# EAGLE design EduBall_V1.1 (EAGLE 7.5.0)
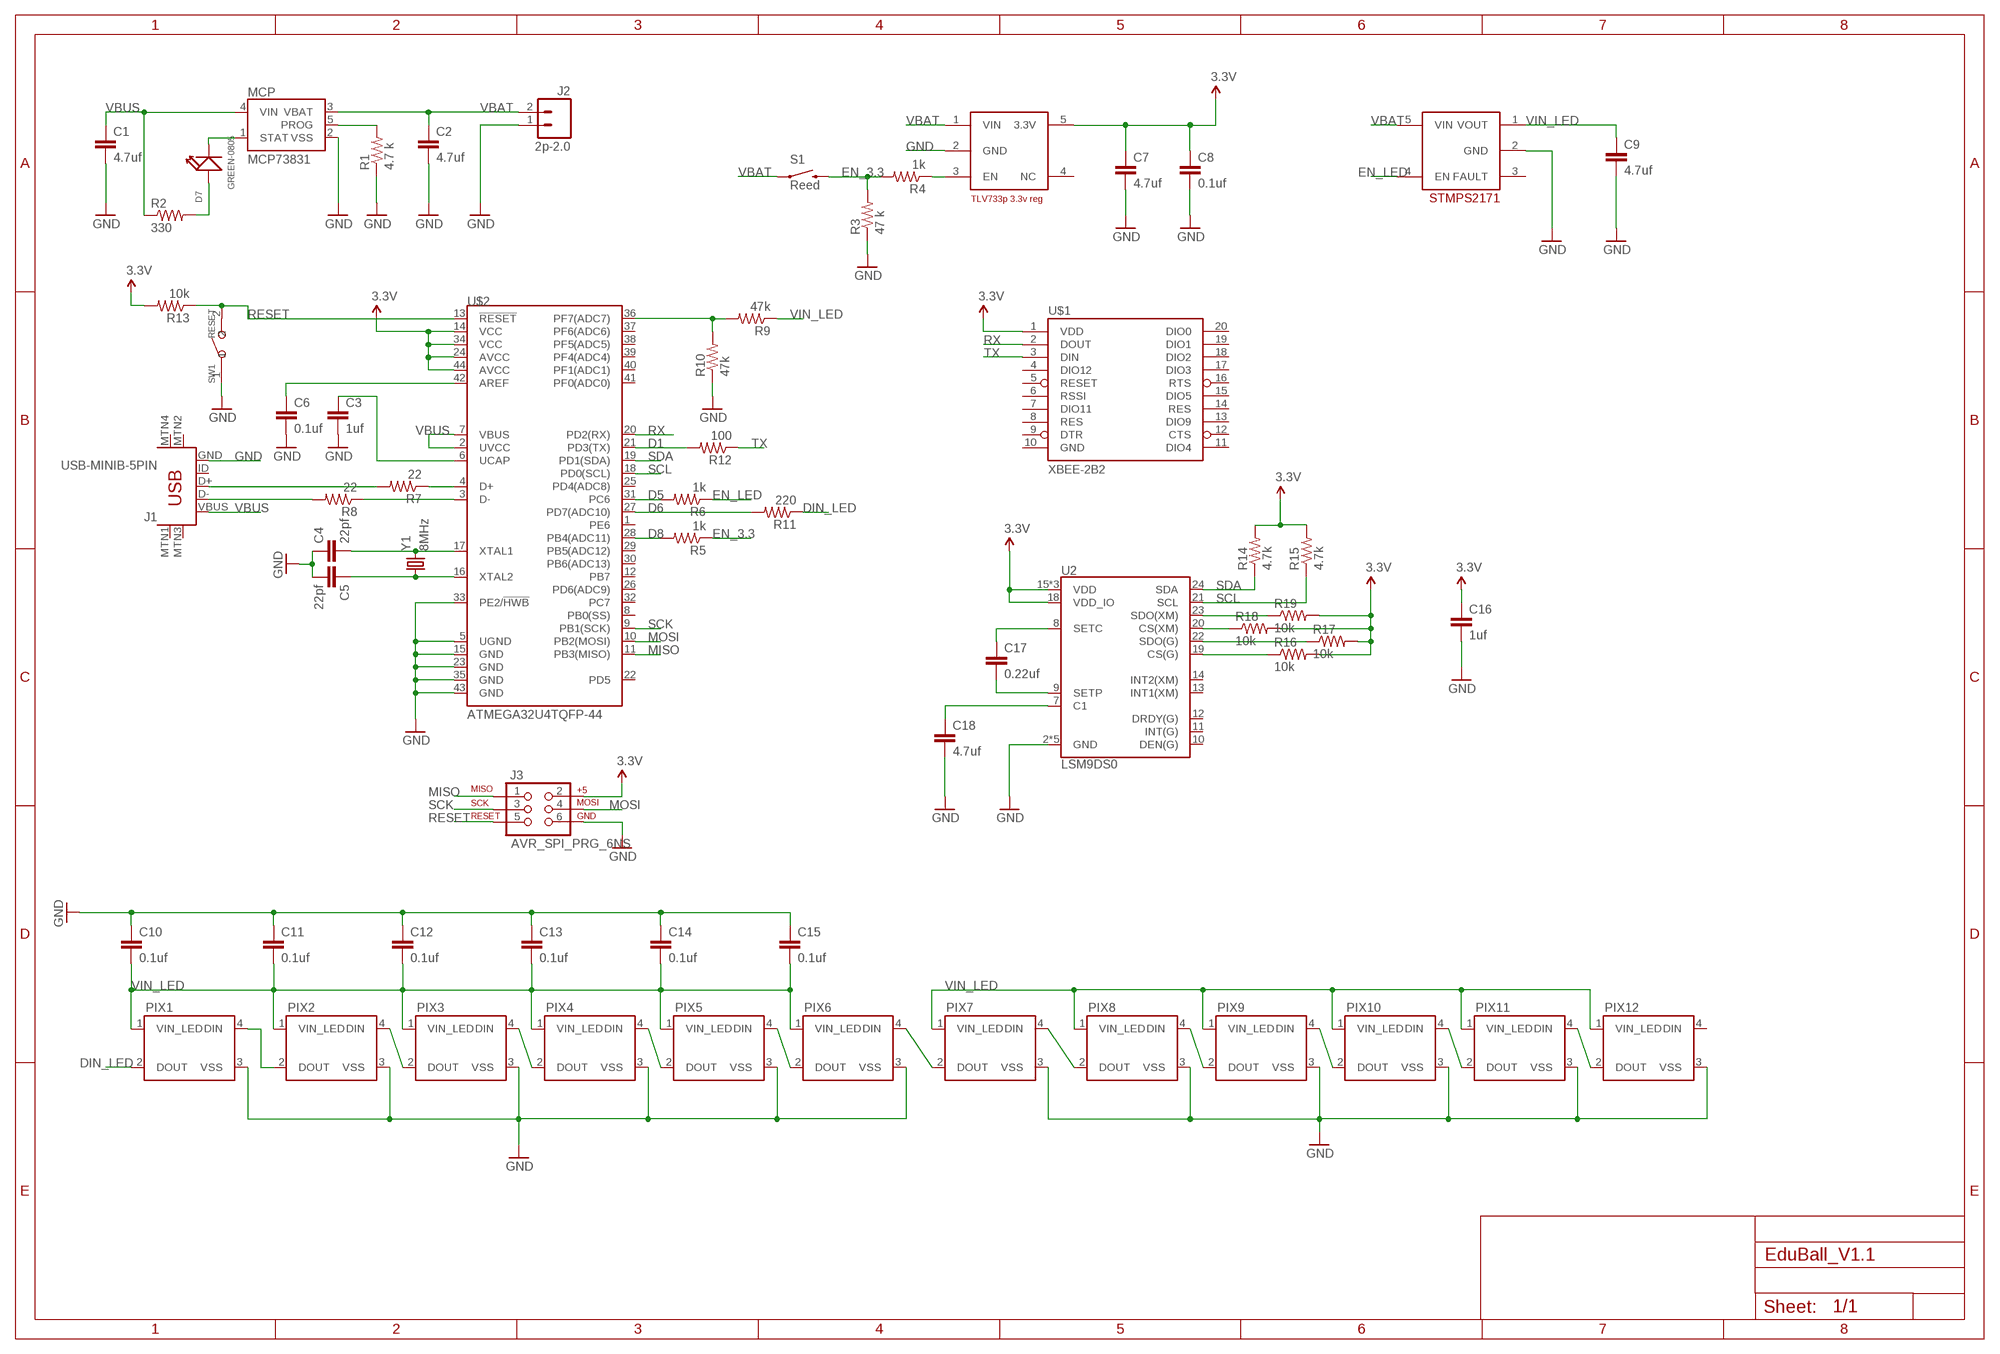
[diagram p0: schematic, sheet 1]

## Parts
C1  4.7uf  CAP0805  [0805]
C2  4.7uf  CAP0805  [0805]
C3  1uf  CAP0805  [0805]
C4  22pf  CAP0805  [0805]
C5  22pf  CAP0805  [0805]
C6  0.1uf  CAP0805  [0805]
C7  4.7uf  CAP0805  [0805]
C8  0.1uf  CAP0805  [0805]
C9  4.7uf  CAP0805  [0805]
C10  0.1uf  CAP0805  [0805]
C11  0.1uf  CAP0805  [0805]
C12  0.1uf  CAP0805  [0805]
C13  0.1uf  CAP0805  [0805]
C14  0.1uf  CAP0805  [0805]
C15  0.1uf  CAP0805  [0805]
C16  1uf  CAP0805  [0805]
C17  0.22uf  CAP0805  [0805]
C18  4.7uf  CAP0805  [0805]
D7  GREEN-0805  SMD-LED-CLEAR-GREEN(0805)  [LED-0805]
J1  USB-MINIB-5PIN  [USB-MINIB]
J2  2p-2.0  M02JST-PTH-VERT  [JST-2-PTH-VERT]
J3  AVR_SPI_PRG_6NS  [2X3-NS]
MCP  MCP73831  [SOT23-5]
PIX1  WS2812B  [WS2812B]
PIX2  WS2812B  [WS2812B]
PIX3  WS2812B  [WS2812B]
PIX4  WS2812B  [WS2812B]
PIX5  WS2812B  [WS2812B]
PIX6  WS2812B  [WS2812B]
PIX7  WS2812B  [WS2812B]
PIX8  WS2812B  [WS2812B]
PIX9  WS2812B  [WS2812B]
PIX10  WS2812B  [WS2812B]
PIX11  WS2812B  [WS2812B]
PIX12  WS2812B  [WS2812B]
R1  4.7 k  RESISTOR0805-RES  [0805]
R2  330  RESISTOR0805-RES  [0805]
R3  47 k  RESISTOR0805-RES  [0805]
R4  1k  RESISTOR0805-RES  [0805]
R5  1k  RESISTOR0805-RES  [0805]
R6  1k  RESISTOR0805-RES  [0805]
R7  22  RESISTOR0805-RES  [0805]
R8  22  RESISTOR0805-RES  [0805]
R9  47k  RESISTOR0805-RES  [0805]
R10  47k  RESISTOR0805-RES  [0805]
R11  220  RESISTOR0805-RES  [0805]
R12  100  RESISTOR0805-RES  [0805]
R13  10k  RESISTOR0805-RES  [0805]
R14  4.7k  RESISTOR0805-RES  [0805]
R15  4.7k  RESISTOR0805-RES  [0805]
R16  10k  RESISTOR0805-RES  [0805]
R17  10k  RESISTOR0805-RES  [0805]
R18  10k  RESISTOR0805-RES  [0805]
R19  10k  RESISTOR0805-RES  [0805]
S1  Reed  SWITCH-MOMENTARY-2PTH_REED  [REED_SWITCH_PTH]
STMP  STMPS2171  [SOT23-5]
SW1  RESET  SMD-BUTTON(2P-3.0X2.5X1.2+0.4MM)-B3U-1000P-2P-SMD  [SW2-2.6-3.0X2.5X1.2+0.4MM]
TLV  TLV3333P  [SOT23-5]
U2  LSM9DS0  [LGA-24]
U$1  XBEE-2B2  [XBEE-SILK]
U$2  ATMEGA32U4TQFP-44  [TQFP44]
Y1  8MHz  CRYSTALHC49US  [HC49US]

## Nets
3.3V: C7.1 C8.1 C16.1 J3.2 R13.2 R14.2 R15.2 R16.2 R17.2 R18.2 R19.2 TLV.5(3.3V) U2.15(VDD) U2.16(VDD) U2.17(VDD) U2.18(VDD_IO) U$1.1(VDD) U$2.14(VCC) U$2.24(AVCC) U$2.34(VCC) U$2.44(AVCC)
D1: R12.2 U$2.21(PD3(TX))
D5: R6.2 U$2.31(PC6)
D6: R11.2 U$2.27(PD7(ADC10))
D8: R5.2 U$2.28(PB4(ADC11))
DIN_LED: PIX1.2(DOUT) R11.1
EN_3.3: R3.2 R4.2 R5.1 S1.P$2
EN_LED: R6.1 STMP.4(EN)
GND: C1.2 C2.2 C3.2 C4.1 C5.2 C6.2 C7.2 C8.2 C9.2 C10.1 C11.1 C12.1 C13.1 C14.1 C15.1 C16.2 C18.2 J1.GND J2.1 J3.6 MCP.2(VSS) PIX1.3(VSS) PIX2.3(VSS) PIX3.3(VSS) PIX4.3(VSS) PIX5.3(VSS) PIX6.3(VSS) PIX7.3(VSS) PIX8.3(VSS) PIX9.3(VSS) PIX10.3(VSS) PIX11.3(VSS) PIX12.3(VSS) R1.1 R3.1 R10.1 STMP.2(GND) SW1.1 TLV.2(GND) U2.2(GND) U2.3(GND) U2.4(GND) U2.5(GND) U2.6(GND) U$2.5(UGND) U$2.15(GND) U$2.23(GND) U$2.33(PE2/!HWB) U$2.35(GND) U$2.43(GND)
MISO: J3.1 U$2.11(PB3(MISO))
MOSI: J3.4 U$2.10(PB2(MOSI))
N$1: MCP.5(PROG) R1.2
N$2: PIX1.4(DIN) PIX2.2(DOUT)
N$3: R4.1 TLV.3(EN)
N$4: D7.- MCP.1(STAT)
N$5: D7.+ R2.2
N$6: PIX2.4(DIN) PIX3.2(DOUT)
N$7: PIX3.4(DIN) PIX4.2(DOUT)
N$8: PIX4.4(DIN) PIX5.2(DOUT)
N$9: PIX5.4(DIN) PIX6.2(DOUT)
N$10: PIX6.4(DIN) PIX7.2(DOUT)
N$11: PIX7.4(DIN) PIX8.2(DOUT)
N$12: PIX8.4(DIN) PIX9.2(DOUT)
N$13: PIX9.4(DIN) PIX10.2(DOUT)
N$14: PIX10.4(DIN) PIX11.2(DOUT)
N$15: PIX11.4(DIN) PIX12.2(DOUT)
N$16: J1.D+ R7.2
N$17: R7.1 U$2.4(D+)
N$18: R8.1 U$2.3(D-)
N$19: J1.D- R8.2
N$20: C3.1 U$2.6(UCAP)
N$21: C6.1 U$2.42(AREF)
N$22: C18.1 U2.7(C1)
N$23: C4.2 U$2.17(XTAL1) Y1.2
N$24: C5.1 U$2.16(XTAL2) Y1.1
N$25: R9.2 R10.2 U$2.36(PF7(ADC7))
N$26: C17.2 U2.9(SETP)
N$27: C17.1 U2.8(SETC)
N$32: R19.1 U2.23(SDO(XM))
N$33: R18.1 U2.20(CS(XM))
N$34: R17.1 U2.22(SDO(G))
N$35: R16.1 U2.19(CS(G))
RESET: J3.5 R13.1 SW1.2 U$2.13(!RESET)
RX: U$1.2(DOUT) U$2.20(PD2(RX))
SCK: J3.3 U$2.9(PB1(SCK))
SCL: R15.1 U2.21(SCL) U$2.18(PD0(SCL))
SDA: R14.1 U2.24(SDA) U$2.19(PD1(SDA))
TX: R12.1 U$1.3(DIN)
VBAT: C2.1 J2.2 MCP.3(VBAT) S1.P$1 STMP.5(VIN) TLV.1(VIN)
VBUS: C1.1 J1.VBUS MCP.4(VIN) R2.1 U$2.2(UVCC) U$2.7(VBUS)
VIN_LED: C9.1 C10.2 C11.2 C12.2 C13.2 C14.2 C15.2 PIX1.1(VIN_LED) PIX2.1(VIN_LED) PIX3.1(VIN_LED) PIX4.1(VIN_LED) PIX5.1(VIN_LED) PIX6.1(VIN_LED) PIX7.1(VIN_LED) PIX8.1(VIN_LED) PIX9.1(VIN_LED) PIX10.1(VIN_LED) PIX11.1(VIN_LED) PIX12.1(VIN_LED) R9.1 STMP.1(VOUT)
Unconnected: J1.ID J1.MTN1(MTN2) J1.MTN2(MTN3) J1.MTN3(MTN1) J1.MTN4 PIX12.4(DIN) STMP.3(FAULT) TLV.4(NC) U2.10(DEN(G)) U2.11(INT(G)) U2.12(DRDY(G)) U2.13(INT1(XM)) U2.14(INT2(XM)) U$1.4(DIO12) U$1.5(RESET) U$1.6(RSSI) U$1.7(DIO11) U$1.8(RES) U$1.9(DTR) U$1.11(DIO4) U$1.12(CTS) U$1.13(DIO9) U$1.14(RES) U$1.15(DIO5) U$1.16(RTS) U$1.17(DIO3) U$1.18(DIO2) U$1.19(DIO1) U$1.20(DIO0) U$2.1(PE6) U$2.8(PB0(SS)) U$2.12(PB7) U$2.22(PD5) U$2.25(PD4(ADC8)) U$2.26(PD6(ADC9)) U$2.29(PB5(ADC12)) U$2.30(PB6(ADC13)) U$2.32(PC7) U$2.37(PF6(ADC6)) U$2.38(PF5(ADC5)) U$2.39(PF4(ADC4)) U$2.40(PF1(ADC1)) U$2.41(PF0(ADC0))

## Power pins joined to a net without a drawn wire
GND: U$1.10(GND)

## Library data of the parts
C1-C18 = SparkFun-Passives:CAP: Capacitor Standard 0603 ceramic capacitor, and 0.1" leaded capacitor.
D7 = Seeed-LED-2016:SMD-LED-CLEAR-GREEN(0805): 304090057; MPN: 17-215SYGC/S530-E2/TR8
J1 = SparkFun-Connectors:USB-MINIB: Mini-USB "B" connector with 5th pin broken out. Created new symbol breaking out 5th "ID" pin in mini/micro USB connector spec. See: http://en.wikipedia.org/wiki/Mini_usb#Cables. Uses same footprint as 4-pin symbol. Also added pins to connect to mounting / shield pads if required (probably not generally needed as signals aren't shielded once they leave the connector).; PROD_ID: CONN-08193
J2 = SparkFun-Connectors:M02: Standard 2-pin 0.1" header. Use with - straight break away headers ( PRT-00116) - right angle break away headers (PRT-00553) - swiss pins (PRT-00743) - machine pins (PRT-00117) - female headers (PRT-00115) Molex polarized connector foot print use with: PRT-08233 with associated crimp pins and housings. 2.54_SCREWTERM for use with PRT-10571. 3.5mm Screw Terminal footprints for PRT-08084 5mm Screw Terminal footprints for use with PRT-08432
J3 = SparkFun-Connectors:AVR_SPI_PRG_6: AVR ISP 6 Pin This is the reduced ISP connector for AVR programming. Common on Arduino. This footprint will take up less PCB space and can be used with a 10-pin to 6-pin adapter such as SKU: BOB-08508 **Special note about "TEST_POINT" package. The stop mask is on the top side, so if you want your programming test points to be on the bottom of your board, make sure to place this package on the bottom side of the board. This also ensure that the orientation to program from the bottom side will be correct.
MCP = SparkFun-PowerIC:MCP73831: Miniature single cell, fully integrated Li-Ion, Li-polymer charge management controller http://ww1.microchip.com/downloads/en/DeviceDoc/20001984g.pdf IC-09995; PROD_ID: IC-09995
PIX1-PIX12 = SparkFun-LED:WS2812B: WS2812B - Intelligent control LED integrated light source Technical Specifications: Power Supply Voltage (VDD): 3.5 to 5.3 V Input Voltage (VI): -0.5 to VDD+0.5 V Operating Junction Temperature (Topt): -25°C to +80°C Storage Temperature Range (Tstg): -55°C to +150°C; PROD_ID: DIO-12503
R1-R19 = SparkFun-Passives:RESISTOR: Resistor Basic schematic elements and footprints for 0603, 1206, and PTH resistors.
S1 = SparkFun-Electromechanical:SWITCH-MOMENTARY-2: Various NO switches- pushbuttons, reed, etc
STMP = Power_Managment:STMPS2171: STMPS2171 high side switch 1000ma
SW1 = Seeed-Switch-2016:SMD-BUTTON(2P-3.0X2.5X1.2+0.4MM): 311020047; MPN: B3U-1000P-2P-SMD; VALUE: B3U-1000P-2P-SMD
TLV = Power_Managment:TLV3333P: TLV733P Capacitor-Free, 300-mA, Low-Dropout Regulator
U2 = SparkFun-DigitalIC:LSM9DS0: LSM9DS0 3D Accelerometer, 3D Gyroscope, 3D Magnetomter Features: 3 acceleration channels, 3 angular rate channels, 3 magnetic field channels ±2/±4/±6/±8/±16 g linear acceleration full scale ±2/±4/±8/±12 gauss magnetic full scale ±245/±500/±2000 dps angular rate full scale 16-bit data output SPI / I2C serial interfaces Analog supply voltage 2.4 V to 3.6 V Power-down mode / low-power mode Programmable interrupt generators Embedded self-test Embedded temperature sensor Embedded FIFO Position and motion detection functions Click/double-click recognition
U$1 = SparkFun-RF:XBEE-2: Xbee module footprints SMT header is CONN-09042.
U$2 = SparkFun-DigitalIC:ATMEGA32U4: Atmel 44-pin 8-bit Microcontroller with 32KBytes of ISP Flash and USB Controller
Y1 = SparkFun-FreqCtrl:CRYSTAL: Various standard crystals. Proven footprints.

## Board
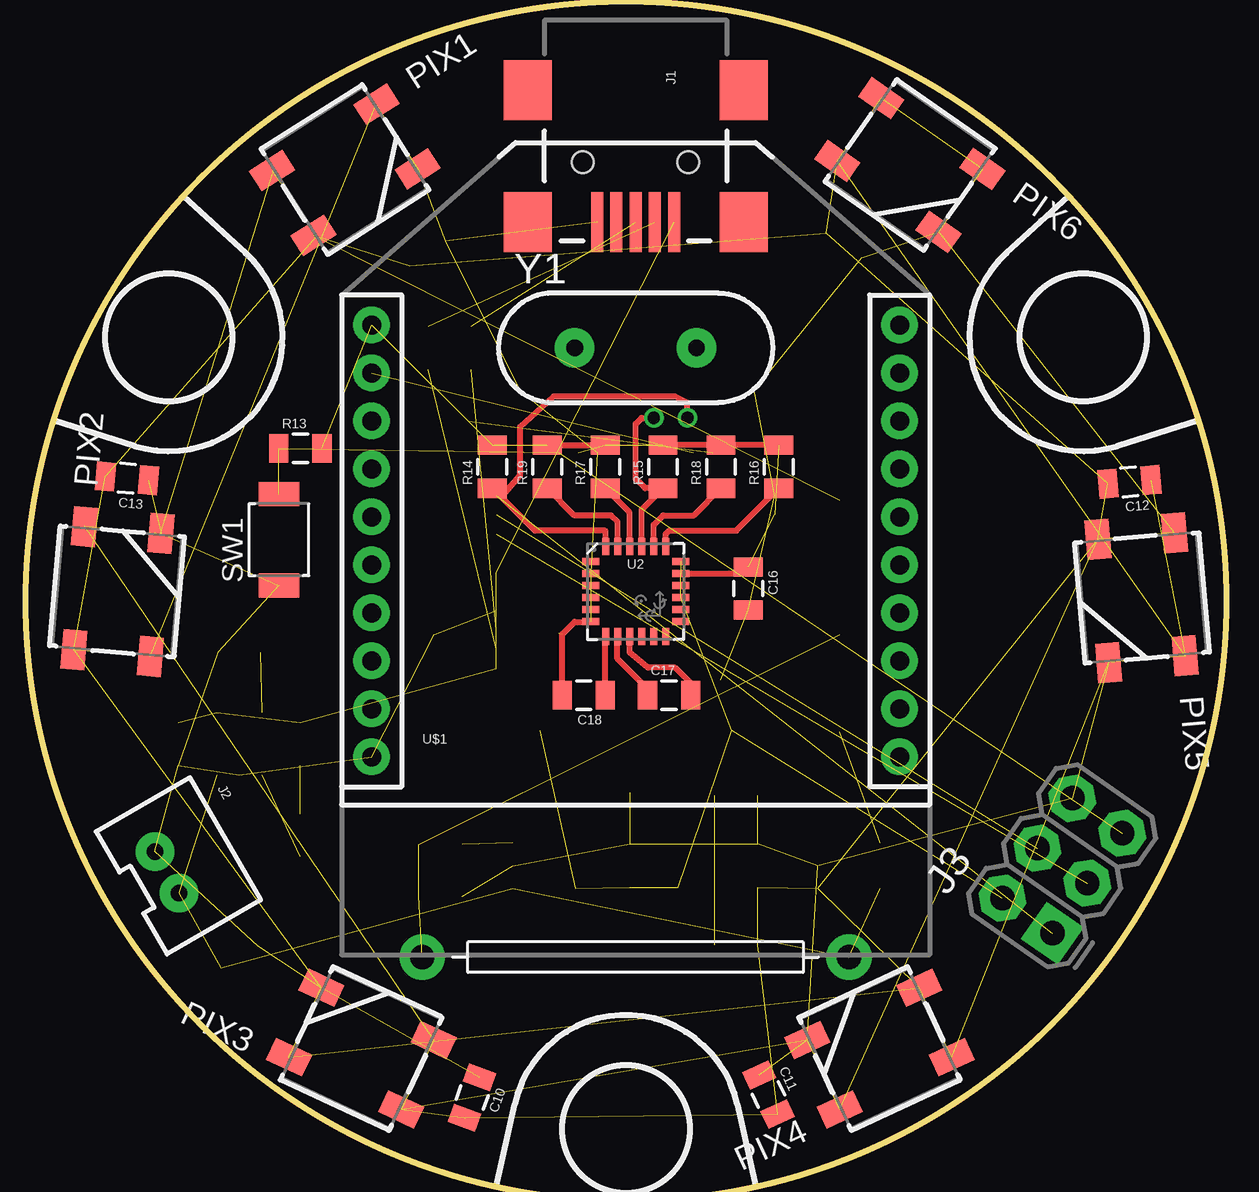
[diagram p1: board, top side]
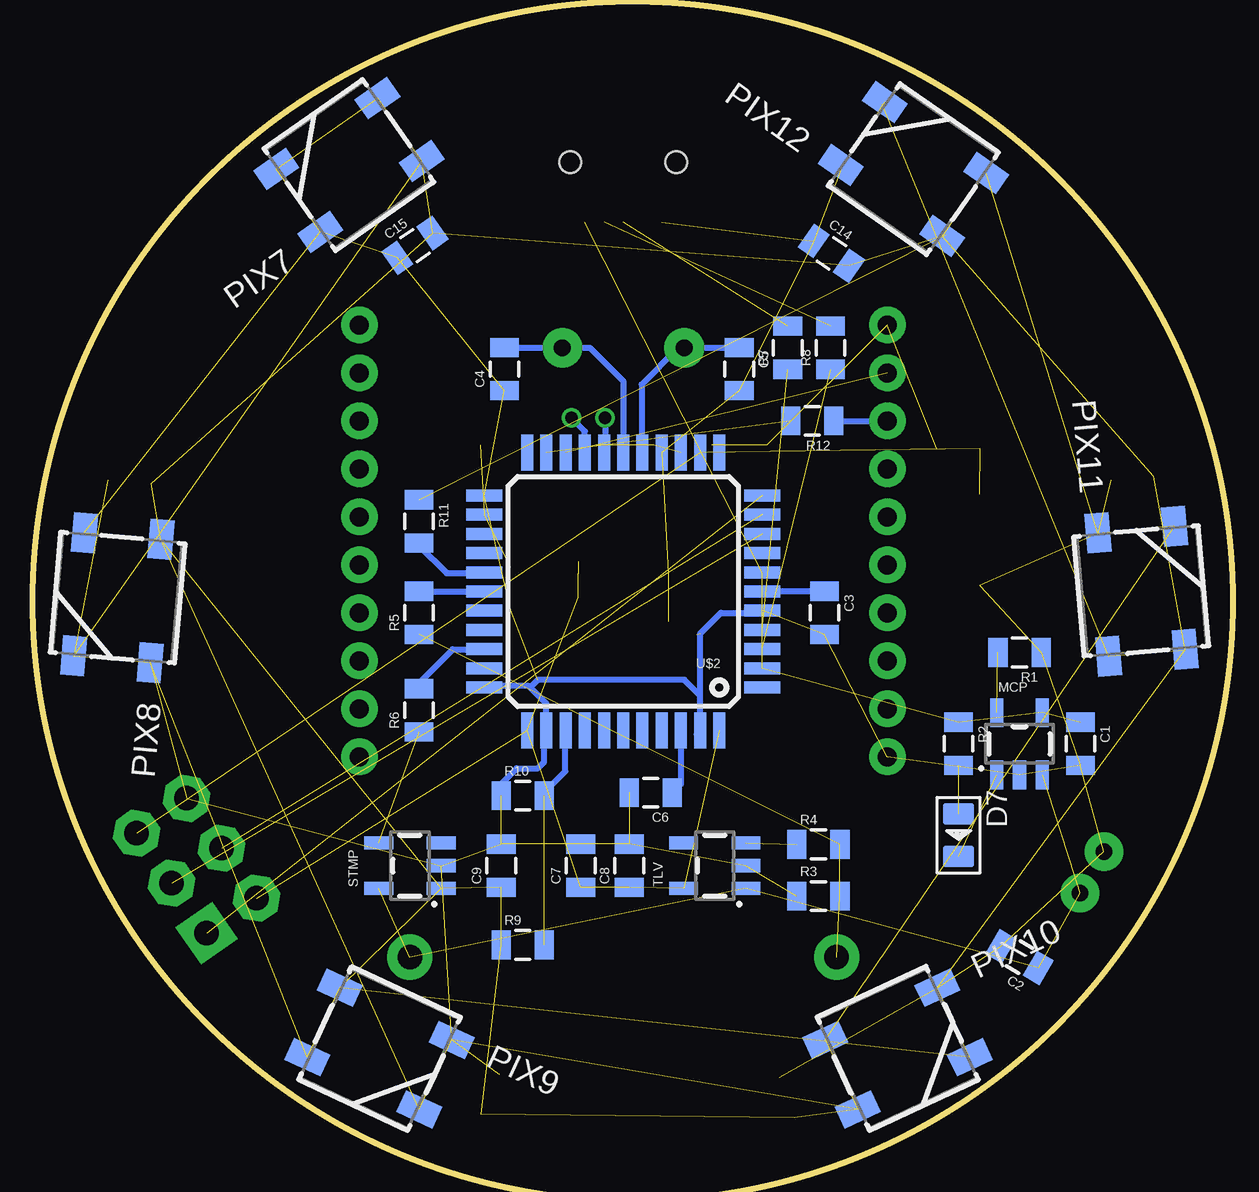
[diagram p2: board, bottom side, seen from below]

No outline drawn. Coordinates in mm, seen from the top.
Copper layers (1*16): Top 0.035mm / dielectric 1.5mm / Bottom 0.035mm
Design rules "SeeedStudio_2layer_DRU_no_angle_20140221": minimum track width 6mil, minimum drill 12mil, track to track 6mil, track to pad 6mil, pad to pad 6mil, via to via 6mil, smd to smd 0mil, copper to edge 10mil, drill to drill 10mil, minimum pad ring 10mil, minimum via ring 6mil, stop-mask expansion 2mil, vias tented up to drill 100mil, thermal gap 10mil
Milling: area 0,0 to 50,50

### Footprints (pad centres in the part's own frame; a part is rotated, then mirrored left to right if it is on the bottom)
0805 = smd 0.8 x 1.2: 1 -0.9,0; 2 0.9,0
LED-0805 = smd 0.889 x 1.27: + -0.889,0; - 0.889,0
USB-MINIB = smd 2.5 x 0.5: D+ 2.5,0; D- 2.5,0.8; GND 2.5,-1.6; ID 2.5,-0.8; VBUS 2.5,1.6 | smd 2.5 x 2: MTN1 -3,4.5; MTN2 2.5,4.5; MTN3 -3,-4.5; MTN4 2.5,-4.5 | hole 0.9: 0,2.2; 0,-2.2
JST-2-PTH-VERT = drill 0.7 pad 1.6: 1 -1,-0.55; 2 1,-0.55
2X3-NS = drill 1.016 pad 1.88 square: 1 -2.54,-1.27 | drill 1.016 pad 1.88 octagon: 2 -2.54,1.27; 3 0,-1.27; 4 0,1.27; 5 2.54,-1.27; 6 2.54,1.27
SOT23-5 = smd 0.55 x 1.2: 1 -0.95,-1.3; 2 0,-1.3; 3 0.95,-1.3; 4 0.95,1.3; 5 -0.95,1.3
WS2812B = smd 1.651 x 1: 1 -2.577,1.6; 2 -2.577,-1.6; 3 2.577,-1.6; 4 2.577,1.6
REED_SWITCH_PTH = drill 1.016 pad 1.88: P$1 -8.89,0; P$2 8.89,0
SW2-2.6-3.0X2.5X1.2+0.4MM = smd 1 x 1.7: 1 -1.9,0; 2 1.9,0
LGA-24 = smd 0.7 x 0.29: 1 -1.875,1.25; 2 -1.875,0.75; 3 -1.875,0.25; 4 -1.875,-0.25; 5 -1.875,-0.75; 6 -1.875,-1.25; 13 1.875,-1.25; 14 1.875,-0.75; 15 1.875,-0.25; 16 1.875,0.25; 17 1.875,0.75; 18 1.875,1.25 | smd 0.29 x 0.7: 7 -1.25,-1.875; 8 -0.75,-1.875; 9 -0.25,-1.875; 10 0.25,-1.875; 11 0.75,-1.875; 12 1.25,-1.875; 19 1.25,1.875; 20 0.75,1.875; 21 0.25,1.875; 22 -0.25,1.875; 23 -0.75,1.875; 24 -1.25,1.875
XBEE-SILK = drill 0.8 pad 1.524: 1 -11,20; 2 -11,18; 3 -11,16; 4 -11,14; 5 -11,12; 6 -11,10; 7 -11,8; 8 -11,6; 9 -11,4; 10 -11,2; 11 11,2; 12 11,4; 13 11,6; 14 11,8; 15 11,10; 16 11,12; 17 11,14; 18 11,16; 19 11,18; 20 11,20
TQFP44 = smd 1.5 x 0.5: 1 -5.8,4; 2 -5.8,3.2; 3 -5.8,2.4; 4 -5.8,1.6; 5 -5.8,0.8; 6 -5.8,0; 7 -5.8,-0.8; 8 -5.8,-1.6; 9 -5.8,-2.4; 10 -5.8,-3.2; 11 -5.8,-4; 23 5.8,-4; 24 5.8,-3.2; 25 5.8,-2.4; 26 5.8,-1.6; 27 5.8,-0.8; 28 5.8,0; 29 5.8,0.8; 30 5.8,1.6; 31 5.8,2.4; 32 5.8,3.2; 33 5.8,4 | smd 0.5 x 1.5: 12 -4,-5.8; 13 -3.2,-5.8; 14 -2.4,-5.8; 15 -1.6,-5.8; 16 -0.8,-5.8; 17 0,-5.8; 18 0.8,-5.8; 19 1.6,-5.8; 20 2.4,-5.8; 21 3.2,-5.8; 22 4,-5.8; 34 4,5.8; 35 3.2,5.8; 36 2.4,5.8; 37 1.6,5.8; 38 0.8,5.8; 39 0,5.8; 40 -0.8,5.8; 41 -1.6,5.8; 42 -2.4,5.8; 43 -3.2,5.8; 44 -4,5.8
HC49US = drill 0.7 pad 1.651: 1 -2.54,0; 2 2.54,0

### Placement (x,y rotation side)
C1  6.35,19.05 270 bottom
C2  8.89,10.16 150 bottom
C3  17.02,24.51 270 bottom
C4  30.35,34.67 90 bottom
C5  20.57,34.67 270 bottom
C6  24.26,17.02 180 bottom
C7  27.18,13.97 90 bottom
C8  25.15,13.97 90 bottom
C9  30.48,13.97 90 bottom
C10  18.59,4.31 250 top
C11  30.93,4.43 295 top
C12  45.97,29.97 185 top
C13  4.2,30.12 175 top
C14  16.73,39.49 325 bottom
C15  34.08,39.82 35 bottom
C16  30.1,25.53 270 top
C17  26.8,21.08 0 top
C18  23.24,21.08 180 top
D7  11.43,15.24 270 bottom
J1  25.4,43.31 270 top
J2  6.35,13.97 300 top
J3  43.18,13.97 55 top
MCP  8.89,19.05 0 bottom
PIX1  13.29,42.98 32.5 top
PIX2  3.81,25.4 85 top
PIX3  13.97,6.35 155 top
PIX4  35.56,6.35 205 top
PIX5  46.48,25.15 275 top
PIX6  36.83,43.18 325 top
PIX7  36.83,43.18 215 bottom
PIX8  46.48,25.15 265 bottom
PIX9  35.56,6.35 335 bottom
PIX10  13.97,6.35 25 bottom
PIX11  3.81,25.42 95 bottom
PIX12  13.31,43.01 145 bottom
R1  8.89,22.86 180 bottom
R2  11.43,19.05 270 bottom
R3  17.27,12.7 0 bottom
R4  17.27,14.86 0 bottom
R5  33.91,24.51 90 bottom
R6  33.91,20.45 90 bottom
R7  18.54,35.56 90 bottom
R8  16.76,35.56 90 bottom
R9  29.59,10.67 0 bottom
R10  29.59,16.89 0 bottom
R11  33.91,28.32 270 bottom
R12  17.53,32.51 180 bottom
R13  11.43,31.37 0 top
R14  19.43,30.61 90 top
R15  26.54,30.61 90 top
R16  31.37,30.61 90 top
R17  24.13,30.61 90 top
R18  28.96,30.61 90 top
R19  21.72,30.61 90 top
S1  25.4,10.16 180 top
STMP  34.29,13.97 90 bottom
SW1  10.54,27.56 90 top
TLV  21.59,13.97 90 bottom
U2  25.4,25.4 0 top
U$1  25.4,16.51 0 top
U$2  25.4,25.4 180 bottom
Y1  25.4,35.56 0 top

### Tracks (layer width: path | path; a pad name or v marks a point on that pad's centre or on a via)
3.3V  (16 unrouted)
  Top 0.254: U2.17 29.82,26.15 C16.1 | R16.2 R18.2 R15.2 | R19.2 R17.2
D1  (1 unrouted)
D5
  Bottom 0.254: R6.2 33.91,21.59 32.51,22.99 31.21,22.99 U$2.31
D6
  Bottom 0.254: R11.2 33.91,27.3 32.77,26.16 31.24,26.16 U$2.27
D8
  Bottom 0.254: R5.2 31.21,25.41 U$2.28
DIN_LED  (1 unrouted)
EN_3.3  (3 unrouted)
EN_LED  (1 unrouted)
GND  (45 unrouted)
  Top 0.254: C18.2 22.34,23.61 22.86,24.13 23.5,24.13 U2.6
  Bottom 0.254: 22.35,19.45 U$2.43 22.2,21.06 | 29.27,21.4 28.6,20.73 U$2.35 28.7,19.5 28.7,18.29 28.96,18.03 29.84,18.03 30.49,17.39 R10.1 | 29.27,21.4 29.34,21.46 31.14,21.46 U$2.33 | 22.2,21.06 22.86,21.72 28.96,21.72 29.27,21.4 | 22.2,21.06 22.2,23.65 21.34,24.51 19.69,24.51 U$2.5
MISO  (1 unrouted)
MOSI  (1 unrouted)
N$1  (1 unrouted)
N$2  (1 unrouted)
N$3  (1 unrouted)
N$4  (1 unrouted)
N$5  (1 unrouted)
N$6  (1 unrouted)
N$7  (1 unrouted)
N$8  (1 unrouted)
N$9  (1 unrouted)
N$10  (1 unrouted)
N$11  (1 unrouted)
N$12  (1 unrouted)
N$13  (1 unrouted)
N$14  (1 unrouted)
N$15  (1 unrouted)
N$16  (1 unrouted)
N$17  (1 unrouted)
N$18  (1 unrouted)
N$19  (1 unrouted)
N$20
  Bottom 0.254: C3.1 19.59,25.41 U$2.6
N$21
  Bottom 0.254: U$2.42 23,17.38 C6.1
N$22
  Top 0.254: C18.1 U2.7
N$23
  Bottom 0.254: C4.2 27.95,35.57 Y1.2 26.8,35.56 25.4,34.16 U$2.17
N$24
  Bottom 0.254: C5.1 20.59,35.56 Y1.1 23.11,35.56 24.64,34.04 24.64,31.24 U$2.16
N$25  (1 unrouted)
  Bottom 0.254: R10.2 28.69,17.03 27.81,17.91 27.81,19.59 U$2.36
N$26
  Top 0.254: C17.2 27.7,21.58 27.05,22.23 25.91,22.23 25.15,22.86 U2.9
N$27
  Top 0.254: C17.1 25.9,21.35 24.64,22.61 24.64,23.51 U2.8
N$32
  Top 0.254: U2.23 24.65,28.31 24.38,28.57 22.85,28.57 R19.1
N$33
  Top 0.254: U2.20 26.15,28.18 26.54,28.57 27.82,28.57 R18.1
N$34
  Top 0.254: U2.22 25.15,28.69 R17.1
N$35
  Top 0.254: U2.19 26.65,27.79 26.8,27.94 29.6,27.94 R16.1
RESET  (3 unrouted)
RX  (1 unrouted)
SCK  (1 unrouted)
SCL  (via drill 0.51)
  Top 0.254: U2.21 25.65,28.81 R15.1 25.79,29.71 25.4,30.1 25.4,32.38 25.65,32.64 v26.16,32.64
  Bottom 0.254: v26.16,32.64 26.16,31.75 26.2,31.75 U$2.18
SDA  (via drill 0.51)
  Top 0.254: U2.24 24.15,27.92 24.13,27.94 21.2,27.94 19.81,29.33 | 19.81,29.33 R14.1 | v27.56,32.64 27.56,33.27 27.05,33.53 21.97,33.53 20.57,32.26 20.57,30.23 19.81,29.33
  Bottom 0.254: U$2.19 27,32.08 v27.56,32.64
TX
  Bottom 0.254: R12.1 U$1.3
VBAT  (5 unrouted)
VBUS  (5 unrouted)
VIN_LED  (20 unrouted)